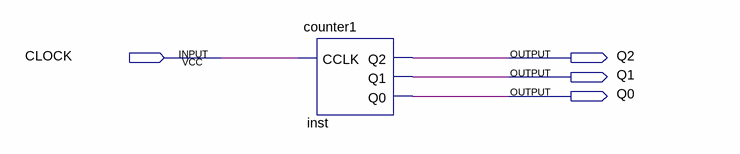
[diagram p0: schematic sheet]
// Quartus schematic test1_no_debouncer.bdf as structural Verilog: 1 symbols, 4 pins
module test1_no_debouncer (
  input  CLOCK,
  output Q2,
  output Q1,
  output Q0
);

  counter1 inst (.CCLK(CLOCK), .Q2(Q2), .Q1(Q1), .Q0(Q0));
endmodule
